# EAGLE design BRAIN_2 (EAGLE 7.5.0)
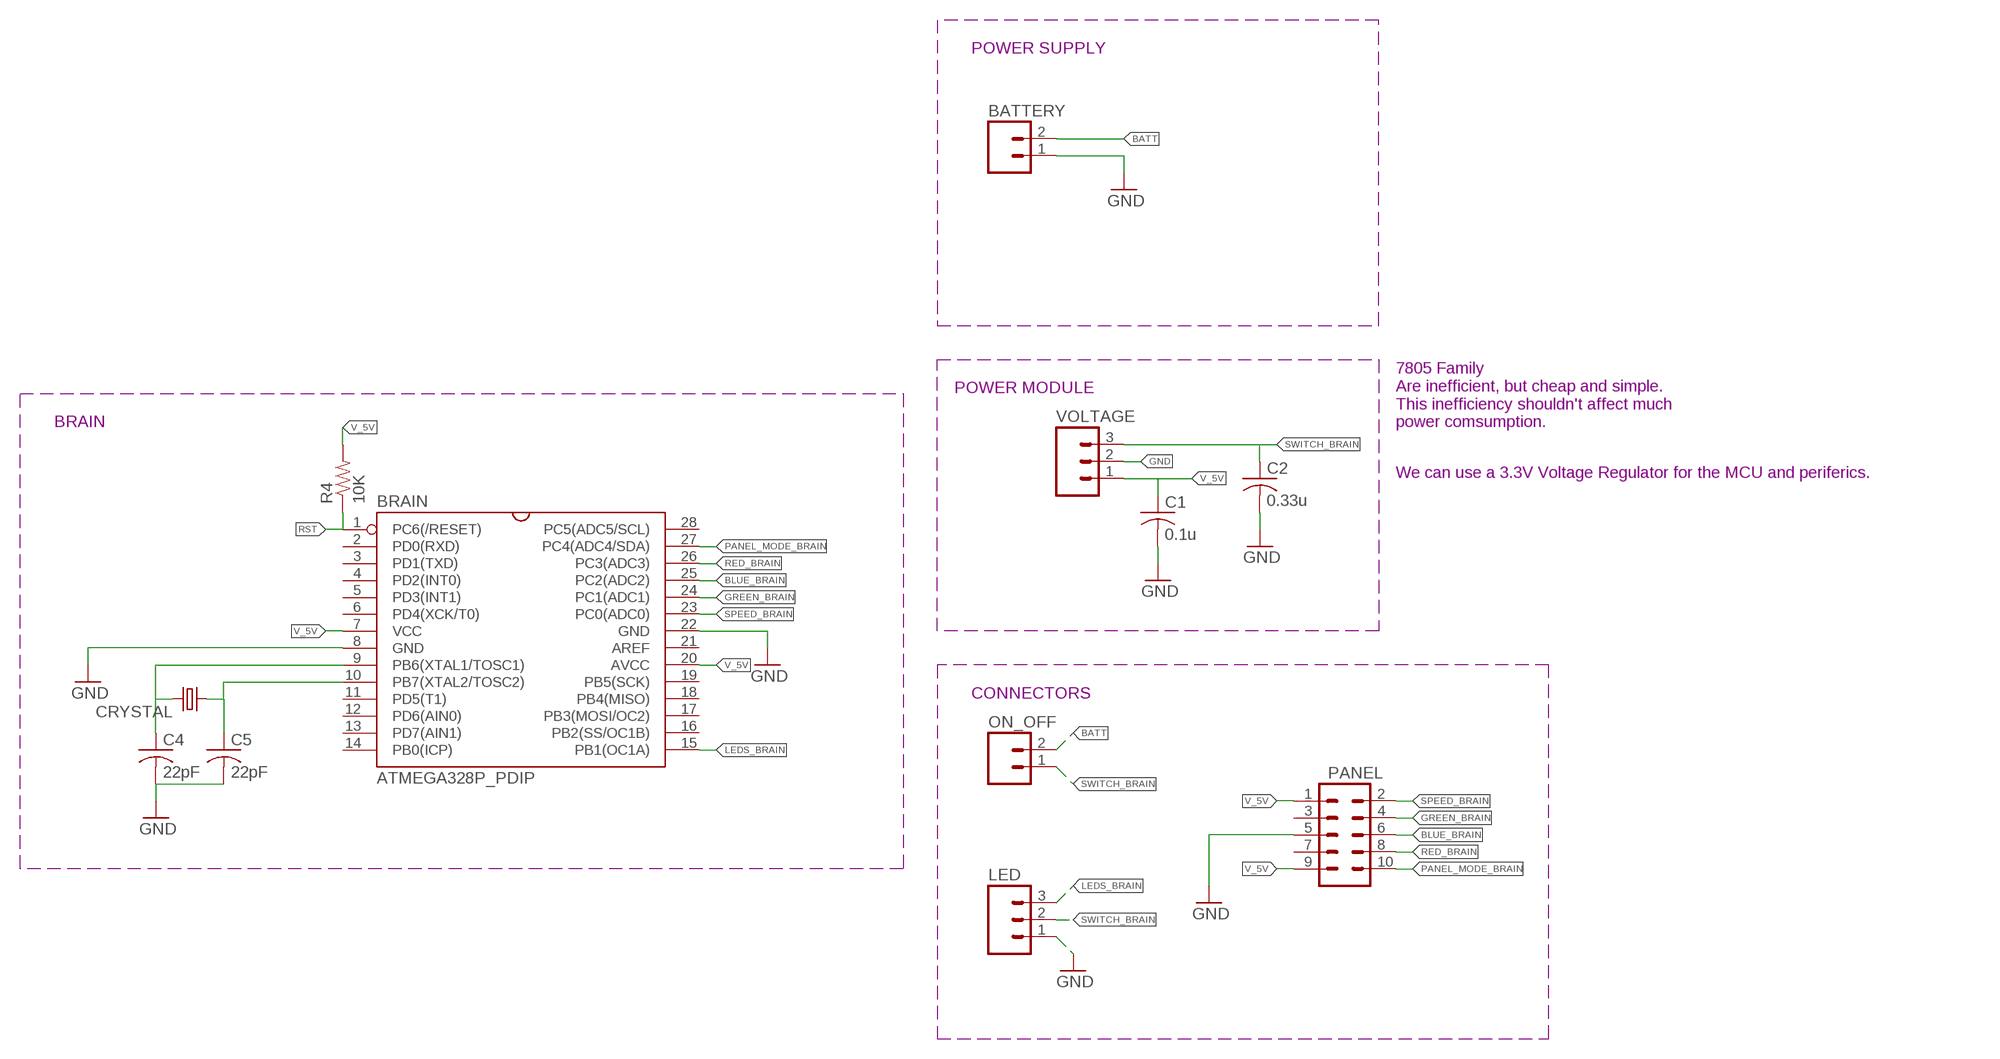
[diagram p0: schematic, sheet 1]

## Parts
BATTERY  M02PTH  [1X02]
BRAIN  ATMEGA328P_PDIP  [DIL-28-3]
C1  0.1u  C-US025-025X050  [C025-025X050]
C2  0.33u  C-US025-025X050  [C025-025X050]
C4  22pF  C-US025-024X044  [C025-024X044]
C5  22pF  C-US025-024X044  [C025-024X044]
CRYSTAL  CRYSTALHC49US  [HC49US]
LED  M03JST-PTH  [JST-3-PTH]
ON_OFF  M02-JST-2-PTH-NO_SILK  [JST-2-PTH-NS]
PANEL  M05X2SHD  [2X5-SHROUDED]
R4  10K  RESISTOR1206  [1206]
VOLTAGE  M03PTH  [1X03]

## Nets
BATT: BATTERY.2 ON_OFF.2
BLUE_BRAIN: BRAIN.25(PC2(ADC2)) PANEL.6
GND: BATTERY.1 BRAIN.8(GND) BRAIN.22(GND) C1.2 C2.2 C4.2 C5.2 LED.1 PANEL.5 VOLTAGE.2
GREEN_BRAIN: BRAIN.24(PC1(ADC1)) PANEL.4
LEDS_BRAIN: BRAIN.15(PB1(OC1A)) LED.3
N$7: BRAIN.9(PB6(XTAL1/TOSC1)) C4.1 CRYSTAL.2
N$8: BRAIN.10(PB7(XTAL2/TOSC2)) C5.1 CRYSTAL.1
PANEL_MODE_BRAIN: BRAIN.27(PC4(ADC4/SDA)) PANEL.10
RED_BRAIN: BRAIN.26(PC3(ADC3)) PANEL.8
RST: BRAIN.1(PC6(/RESET)) R4.1
SPEED_BRAIN: BRAIN.23(PC0(ADC0)) PANEL.2
SWITCH_BRAIN: C2.1 LED.2 ON_OFF.1 VOLTAGE.3
V_5V: BRAIN.7(VCC) BRAIN.20(AVCC) C1.1 PANEL.1 PANEL.9 R4.2 VOLTAGE.1
Unconnected: BRAIN.2(PD0(RXD)) BRAIN.3(PD1(TXD)) BRAIN.4(PD2(INT0)) BRAIN.5(PD3(INT1)) BRAIN.6(PD4(XCK/T0)) BRAIN.11(PD5(T1)) BRAIN.12(PD6(AIN0)) BRAIN.13(PD7(AIN1)) BRAIN.14(PB0(ICP)) BRAIN.16(PB2(SS/OC1B)) BRAIN.17(PB3(MOSI/OC2)) BRAIN.18(PB4(MISO)) BRAIN.19(PB5(SCK)) BRAIN.21(AREF) BRAIN.28(PC5(ADC5/SCL)) PANEL.3 PANEL.7

## Notes on the sheet
- POWER SUPPLY
- POWER MODULE
- BRAIN
- 7805 Family
  Are inefficient, but cheap and simple.
  This inefficiency shouldn't affect much
  power comsumption.
- We can use a 3.3V Voltage Regulator for the MCU and periferics.
- CONNECTORS

## Library data of the parts
BATTERY ON_OFF = SparkFun-Connectors:M02: Standard 2-pin 0.1" header. Use with - straight break away headers ( PRT-00116) - right angle break away headers (PRT-00553) - swiss pins (PRT-00743) - machine pins (PRT-00117) - female headers (PRT-00115) Molex polarized connector foot print use with: PRT-08233 with associated crimp pins and housings. 2.54_SCREWTERM for use with PRT-10571. 3.5mm Screw Terminal footprints for PRT-08084 5mm Screw Terminal footprints for use with PRT-08432
BRAIN = RodrigoMarques_Parts:ATMEGA328P_PDIP: uC used in the Arduino 32kb flash, 1k EEPROM, 2k SRAM This is the through-hole version of this chip.
C1 C2 C4 C5 = adafruit:C-US: CAPACITOR, American symbol
CRYSTAL = SparkFun-FreqCtrl:CRYSTAL: Various standard crystals. Proven footprints.
LED = SparkFun-Connectors:M03: Header 3 Standard 3-pin 0.1" header. Use with straight break away headers (SKU : PRT-00116), right angle break away headers (PRT-00553), swiss pins (PRT-00743), machine pins (PRT-00117), and female headers (PRT-00115). Molex polarized connector foot print use with SKU : PRT-08232 with associated crimp pins and housings.; SKU: PRT-09915
PANEL = SparkFun-Connectors:M05X2: Header 5x2 Standard 10-pin dual row 0.1" header. Commonly used with AVR-ISP. Use with Spark Fun Electronics SKU: PRT-00778
R4 = SparkFun-Resistors:RESISTOR: Resistor Basic schematic elements and footprints for 0603, 1206, and PTH resistors.
VOLTAGE = SparkFun-Connectors:M03: Header 3 Standard 3-pin 0.1" header. Use with straight break away headers (SKU : PRT-00116), right angle break away headers (PRT-00553), swiss pins (PRT-00743), machine pins (PRT-00117), and female headers (PRT-00115). Molex polarized connector foot print use with SKU : PRT-08232 with associated crimp pins and housings.

## Net classes
0 default: width 1.016 mm

## Board
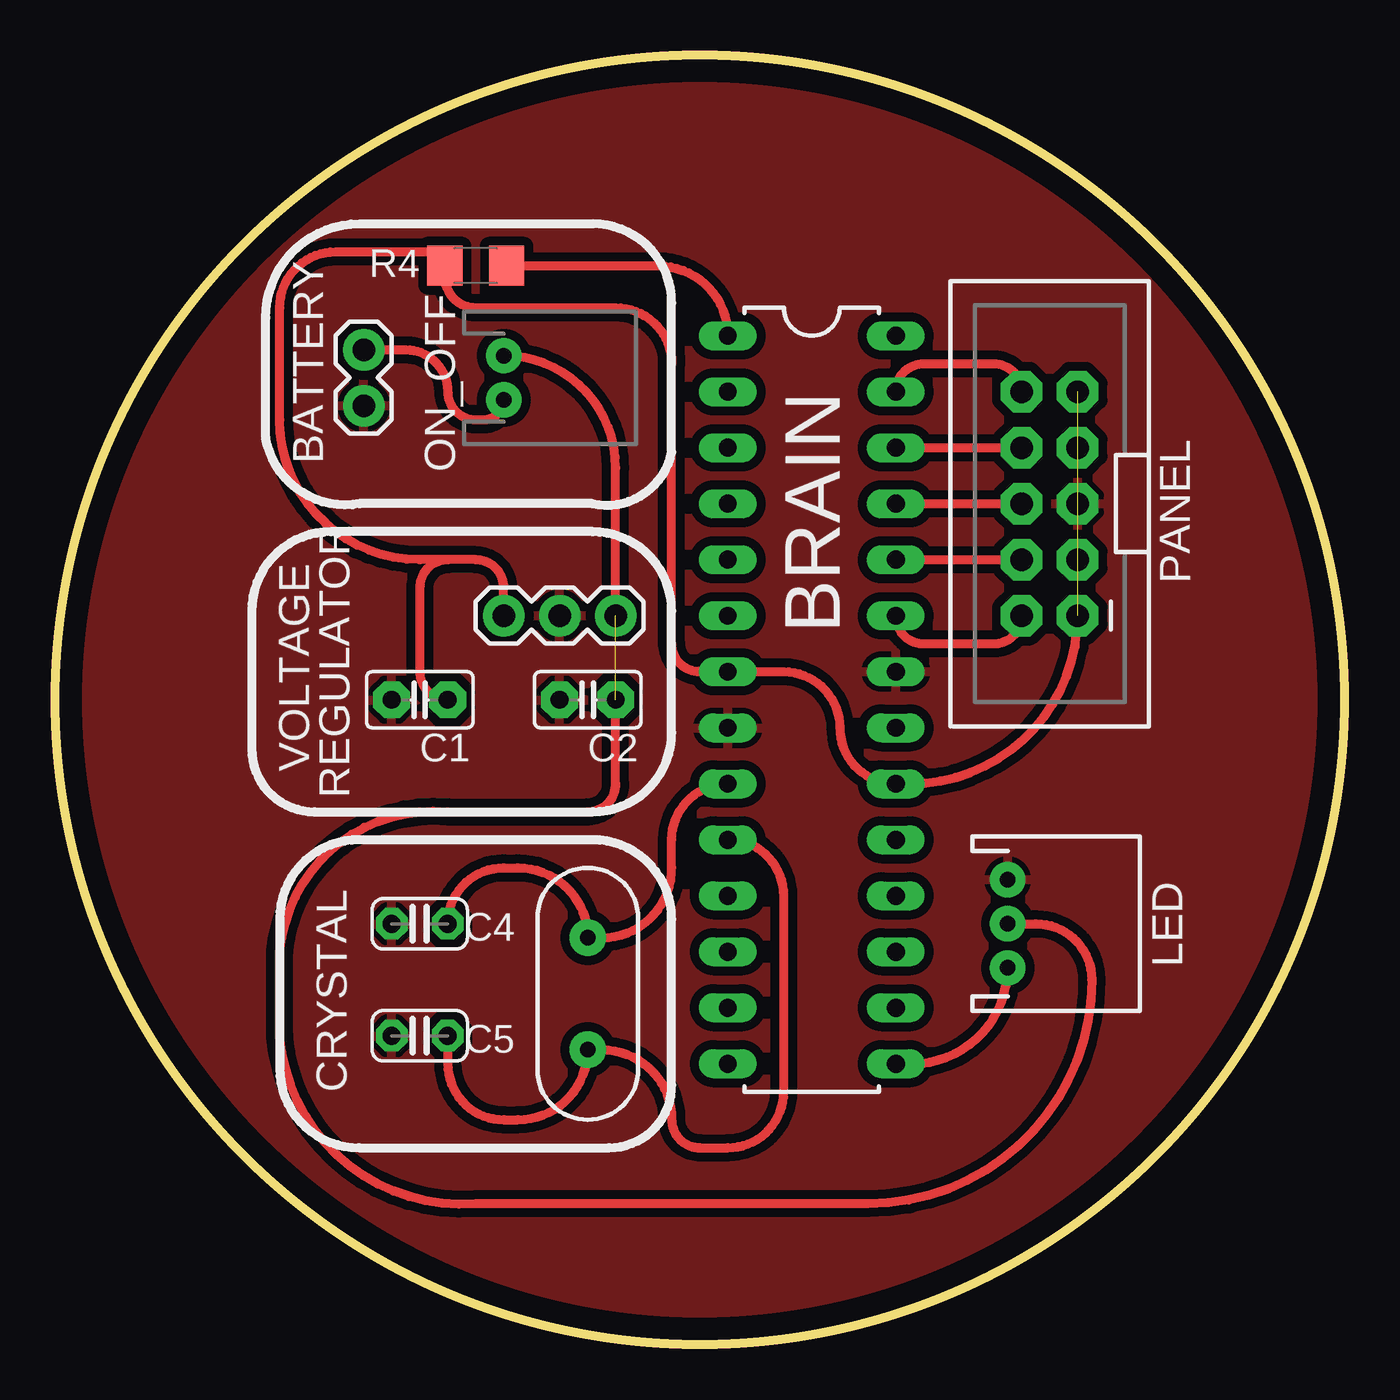
[diagram p1: board, top side]

Size 58.48 x 58.48 mm. Coordinates in mm from the lower left corner, seen from the top.
Outline: circle at 29.24,29.24 radius 29.24
Copper layers (1*16): Top 0.035mm / dielectric 1.5mm / Bottom 0.035mm
Design rules "default *": minimum track width 10mil, minimum drill 24mil, track to track 16mil, track to pad 8mil, pad to pad 8mil, via to via 8mil, smd to smd 8mil, copper to edge 40mil, drill to drill 8mil, minimum pad ring 10mil, minimum via ring 8mil, stop-mask expansion 4mil, vias tented up to drill 0mil, thermal gap 10mil

### Footprints (pad centres in the part's own frame; a part is rotated, then mirrored left to right if it is on the bottom)
1X02 = drill 1.016 pad 1.88: 1 0,0; 2 2.54,0
DIL-28-3 = drill 0.813 long: 1 -16.51,-3.81; 2 -13.97,-3.81; 3 -11.43,-3.81; 4 -8.89,-3.81; 5 -6.35,-3.81; 6 -3.81,-3.81; 7 -1.27,-3.81; 8 1.27,-3.81; 9 3.81,-3.81; 10 6.35,-3.81; 11 8.89,-3.81; 12 11.43,-3.81; 13 13.97,-3.81; 14 16.51,-3.81; 15 16.51,3.81; 16 13.97,3.81; 17 11.43,3.81; 18 8.89,3.81; 19 6.35,3.81; 20 3.81,3.81; 21 1.27,3.81; 22 -1.27,3.81; 23 -3.81,3.81; 24 -6.35,3.81; 25 -8.89,3.81; 26 -11.43,3.81; 27 -13.97,3.81; 28 -16.51,3.81
C025-025X050 = drill 0.813 pad 1.676 octagon: 1 -1.27,0; 2 1.27,0
C025-024X044 = drill 0.813 pad 1.422 octagon: 1 -1.27,0; 2 1.27,0
HC49US = drill 0.7 pad 1.651: 1 -2.54,0; 2 2.54,0
JST-3-PTH = drill 0.7 pad 1.6: 1 -2,0; 2 0,0; 3 2,0
JST-2-PTH-NS = drill 0.7 pad 1.6: 1 -1,0; 2 1,0
2X5-SHROUDED = drill 1.016 pad 1.88 octagon: 1 -1.27,5.08; 2 1.27,5.08; 3 -1.27,2.54; 4 1.27,2.54; 5 -1.27,0; 6 1.27,0; 7 -1.27,-2.54; 8 1.27,-2.54; 9 -1.27,-5.08; 10 1.27,-5.08
1206 = smd 1.6 x 1.8: 1 -1.4,0; 2 1.4,0
1X03 = drill 1.016 pad 1.88: 1 0,0; 2 2.54,0; 3 5.08,0

### Placement (x,y rotation side)
BATTERY  14,42.57 90 top
BRAIN  34.32,29.24 270 top
C1  16.54,29.24 180 top
C2  24.16,29.24 180 top
C4  16.54,19.08 180 top
C5  16.54,14 180 top
CRYSTAL  24.16,15.9 90 top
LED  43.21,19.08 270 top
ON_OFF  20.35,43.84 270 top
PANEL  45.11,38.13 180 top
R4  19.08,48.92 180 top
VOLTAGE  20.35,33.05 0 top

### Tracks (layer width: path | path; a pad name or v marks a point on that pad's centre or on a via)
BATT
  Top 0.406: BATTERY.2 15.9,45.11 arc-90 17.81,43.21 arc90 19.08,41.94 19.44,41.94 arc90 ON_OFF.2
BLUE_BRAIN
  Top 0.406: BRAIN.25 PANEL.6
GND
  pour Top: -7.59,67.34 -7.59,-6.32 66.07,-6.32 66.07,68.61 -7.59,68.61
GREEN_BRAIN
  Top 0.406: BRAIN.24 PANEL.4
LEDS_BRAIN
  Top 0.406: BRAIN.15 38.86,12.73 arc90 LED.3
N$7
  Top 0.406: BRAIN.9 arc90 27.97,22.89 27.97,21.62 arc-90 24.79,18.44 CRYSTAL.2 arc90 20.98,21.62 20.35,21.62 arc90 C4.1
N$8
  Top 0.406: BRAIN.10 arc-90 33.05,20.35 33.05,11.46 arc-90 30.51,8.92 29.24,8.92 arc-90 27.97,10.19 arc90 24.79,13.36 CRYSTAL.1 arc-90 20.98,10.19 20.35,10.19 arc-90 17.81,12.73 C5.1
PANEL_MODE_BRAIN
  Top 0.406: BRAIN.27 arc-90 39.4,44.48 42.57,44.48 arc-90 PANEL.10
RED_BRAIN
  Top 0.406: BRAIN.26 PANEL.8
RST
  Top 0.406: BRAIN.1 arc90 27.33,48.92 R4.1
SPEED_BRAIN
  Top 0.406: BRAIN.23 arc90 39.4,31.78 42.57,31.78 arc90 PANEL.2
SWITCH_BRAIN  (1 unrouted)
  Top 0.406: LED.2 44.48,19.08 arc-90 47.02,16.54 arc-90 36.86,6.38 19.08,6.38 arc-90 10.19,14 10.19,17.81 arc-90 17.81,24.16 24.16,24.16 arc90 25.43,25.43 C2.1 | VOLTAGE.3 25.43,39.76 arc90 ON_OFF.1
V_5V  (1 unrouted)
  Top 0.406: PANEL.1 arc-90 38.76,25.43 BRAIN.20 arc-90 35.59,27.97 arc90 33.05,30.51 BRAIN.7 29.24,30.51 arc-90 27.97,31.78 27.97,44.48 arc90 25.43,47.02 19.08,47.02 arc-90 17.68,48.42 R4.2 arc90 17.04,49.56 12.73,49.56 arc90 10.19,47.02 10.19,41.94 arc90 16.54,35.59 17.81,35.59 | VOLTAGE.1 20.35,34.32 arc90 19.08,35.59 17.81,35.59 | 17.81,35.59 arc90 16.54,34.32 16.54,30.51 arc90 C1.1

### Text on the board
tPlace: REGULATOR